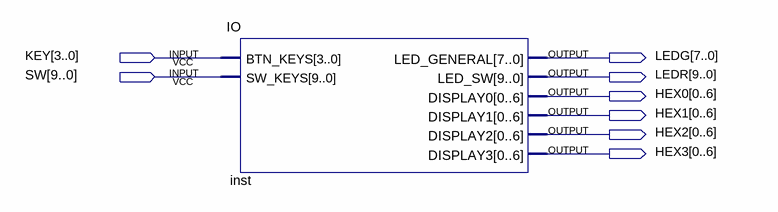
[diagram p0: schematic sheet]
// Quartus schematic TestNeuron.bdf as structural Verilog: 1 symbols, 8 pins
module TestNeuron (
  input  [3:0] KEY,
  input  [9:0] SW,
  output [7:0] LEDG,
  output [9:0] LEDR,
  output [0:6] HEX0,
  output [0:6] HEX1,
  output [0:6] HEX2,
  output [0:6] HEX3
);

  IO inst (
    .BTN_KEYS(KEY), .SW_KEYS(SW), .LED_GENERAL(LEDG), .LED_SW(LEDR), .DISPLAY0(HEX0), .DISPLAY1(HEX1),
    .DISPLAY2(HEX2), .DISPLAY3(HEX3));
endmodule
